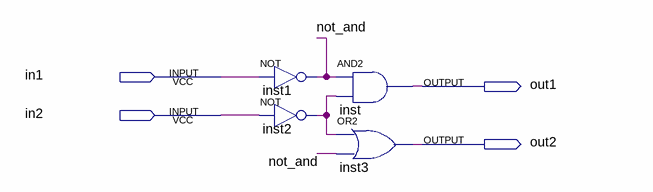
[diagram p0: schematic sheet]
// Quartus schematic andGate.bdf as structural Verilog: 4 symbols, 4 pins
module andGate (
  input  in1,
  input  in2,
  output out1,
  output out2
);

  wire inst2_out, not_and;

  not inst1 (not_and, in1);
  not inst2 (inst2_out, in2);
  and inst (out1, not_and, inst2_out);
  or inst3 (out2, inst2_out, not_and);
endmodule
